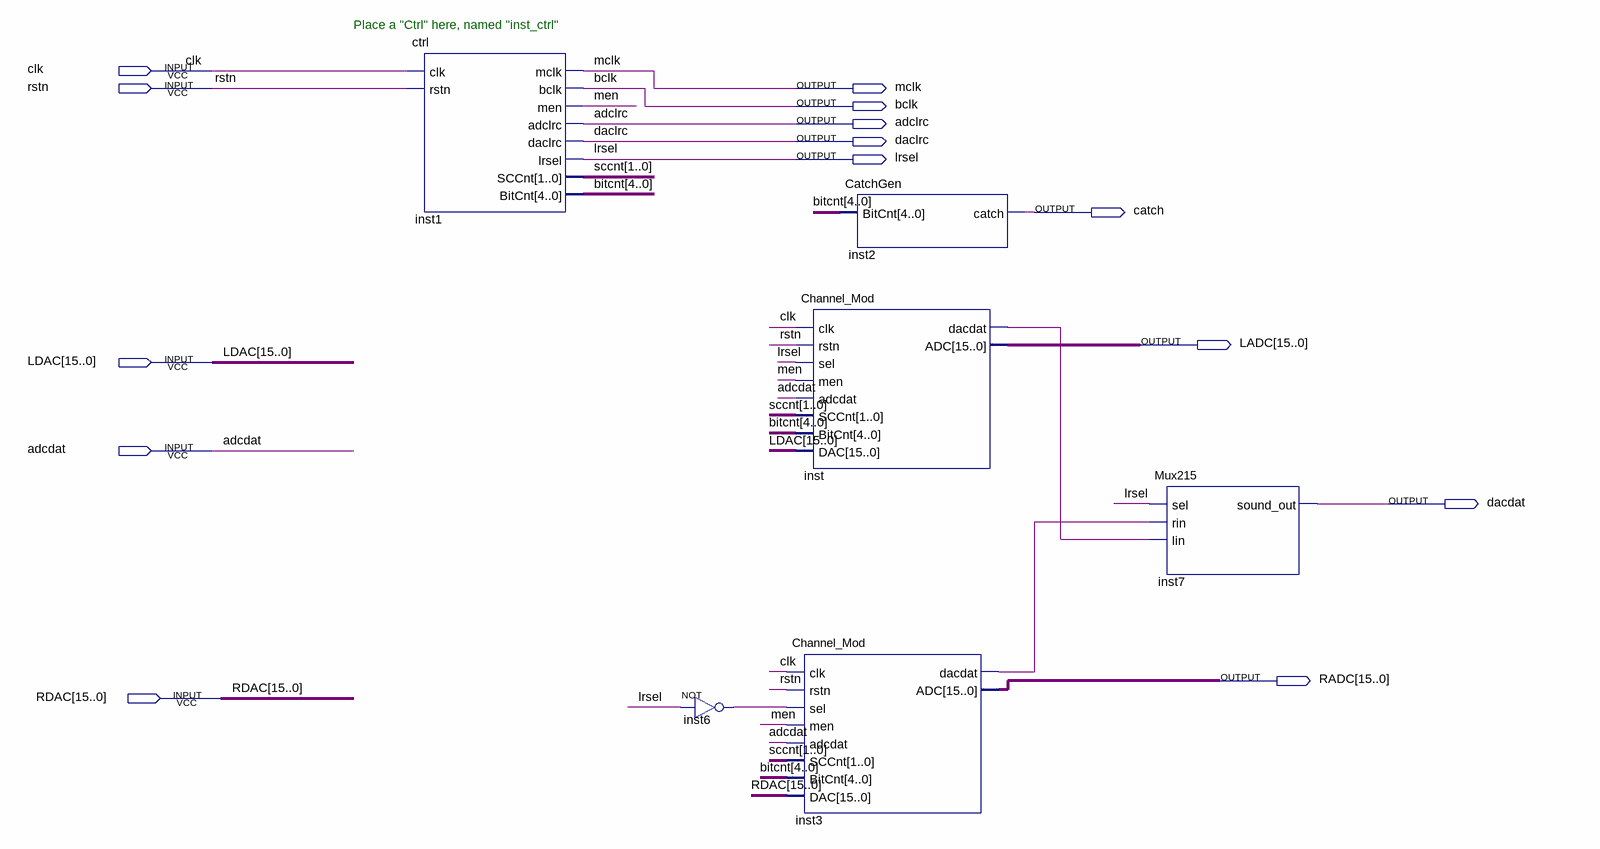
[diagram p0: schematic sheet]
// Quartus schematic SndDriver.bdf as structural Verilog: 6 symbols, 14 pins
module SndDriver (
  input  clk,
  input  rstn,
  input  [15:0] LDAC,
  input  adcdat,
  input  [15:0] RDAC,
  output mclk,
  output bclk,
  output adclrc,
  output daclrc,
  output lrsel,
  output catch,
  output [15:0] LADC,
  output dacdat,
  output [15:0] RADC
);

  wire inst3_dacdat, inst6_out, inst_dacdat, men;
  wire [1:0] sccnt;
  wire [4:0] bitcnt;

  ctrl inst1 (
    .clk(clk), .rstn(rstn), .mclk(mclk), .bclk(bclk), .men(men), .adclrc(adclrc), .daclrc(daclrc),
    .lrsel(lrsel), .SCCnt(sccnt), .BitCnt(bitcnt));
  not inst6 (inst6_out, lrsel);
  CatchGen inst2 (.BitCnt(bitcnt), .catch(catch));
  Channel_Mod inst (
    .clk(clk), .rstn(rstn), .sel(lrsel), .men(men), .adcdat(adcdat), .SCCnt(sccnt), .BitCnt(bitcnt),
    .DAC(LDAC), .dacdat(inst_dacdat), .ADC(LADC));
  Channel_Mod inst3 (
    .clk(clk), .rstn(rstn), .sel(inst6_out), .men(men), .adcdat(adcdat), .SCCnt(sccnt), .BitCnt(bitcnt),
    .DAC(RDAC), .dacdat(inst3_dacdat), .ADC(RADC));
  Mux215 inst7 (.sel(lrsel), .rin(inst3_dacdat), .lin(inst_dacdat), .sound_out(dacdat));

  // Notes on the sheet:
  //   Place a "Ctrl" here, named "inst_ctrl"
endmodule
